# Altium schematic sheet CUSP_PI_Hat.SchDoc
size A4; SheetNumber: 1; SheetTotal: 1
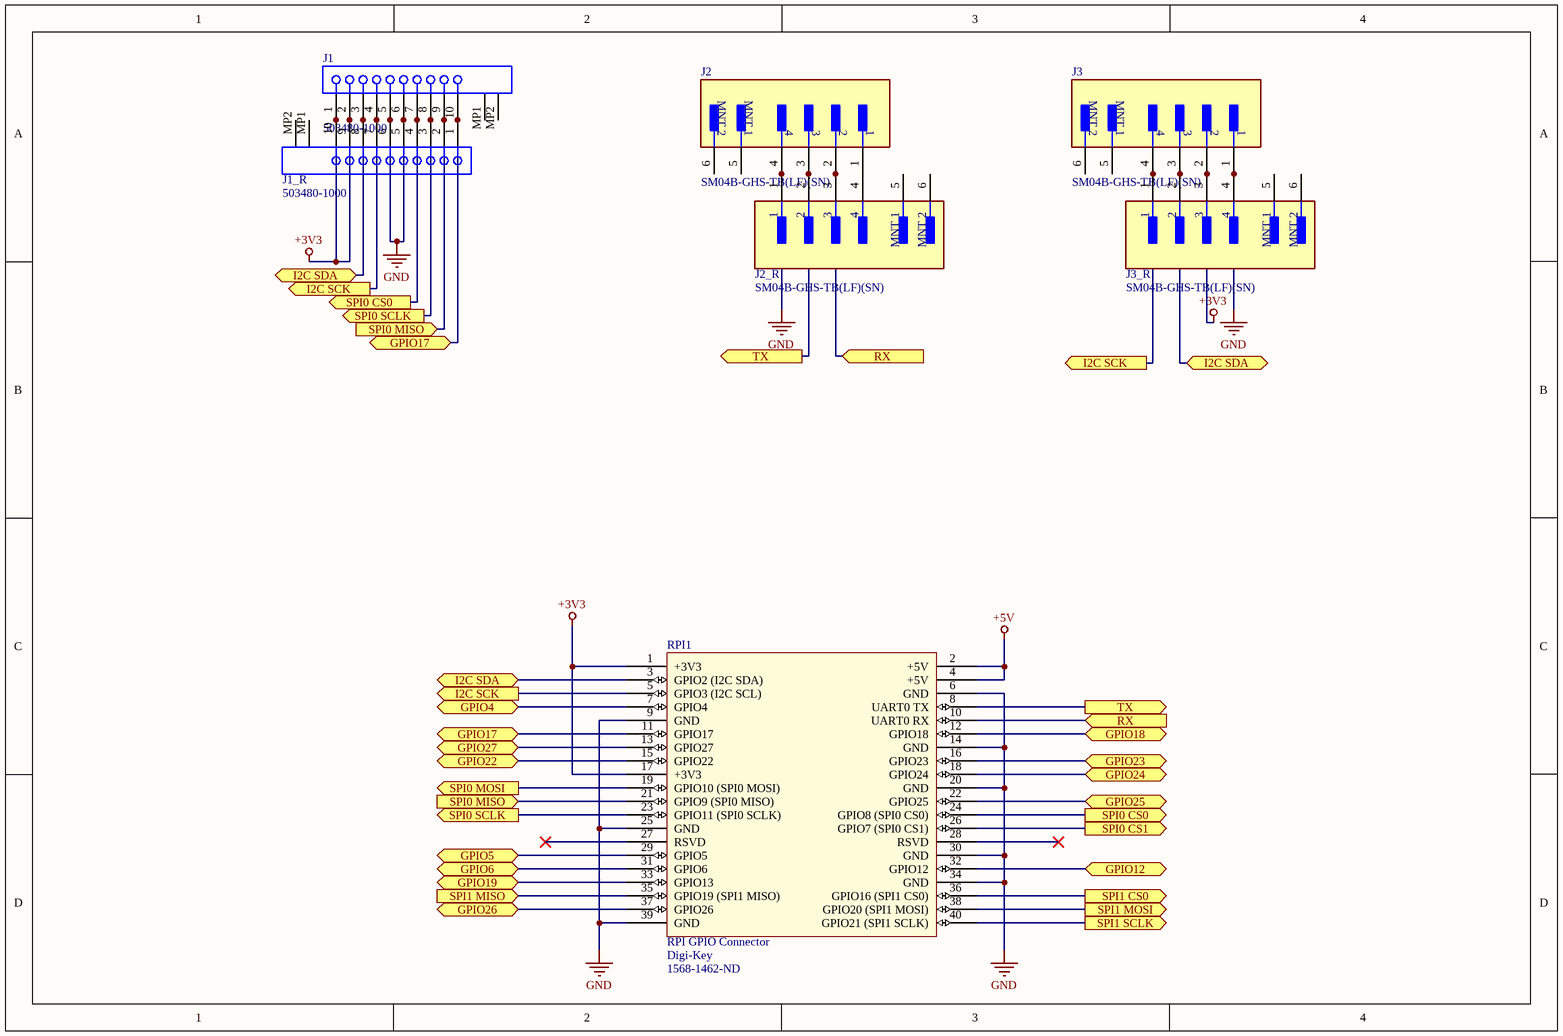
[diagram p0: CUSP_PI_Hat.SchDoc]

## Parts
J1  503480-1000  [MOLX-503480-1000]
J1_R  503480-1000  [MOLX-503480-1000]
J2  SM04B-GHS-TB(LF)(SN)  [FP-SM04B-GHS-TB_LF_SN-MFG]
J2_R  SM04B-GHS-TB(LF)(SN)  [FP-SM04B-GHS-TB_LF_SN-MFG]
J3  SM04B-GHS-TB(LF)(SN)  [FP-SM04B-GHS-TB_LF_SN-MFG]
J3_R  SM04B-GHS-TB(LF)(SN)  [FP-SM04B-GHS-TB_LF_SN-MFG]
RPI1  RPI GPIO Connector  Supplier 1: Digi-Key  Supplier Part Number 1: 1568-1462-ND  [rpi]

## Ports
GPIO4 (bidir), GPIO5 (bidir), GPIO6 (bidir), GPIO12 (bidir), GPIO17 (bidir), GPIO18 (bidir), GPIO19 (bidir), GPIO22 (bidir), GPIO23 (bidir), GPIO24 (bidir), GPIO25 (bidir), GPIO26 (bidir), GPIO27 (bidir), I2C SCK (out), I2C SDA (bidir), RX (in), SPI0 CS0 (out), SPI0 CS1 (out), SPI0 MISO (in), SPI0 MOSI (out), SPI0 SCLK (out), SPI1 CS0 (out), SPI1 MISO (in), SPI1 MOSI (out), SPI1 SCLK (out), TX (out)

## Nets
+3V3: J1.1 J1.2 J1_R.9 J1_R.10 J3.2 J3_R.3 RPI1.1(+3V3) RPI1.17(+3V3)
+5V: RPI1.2(+5V) RPI1.4(+5V)
GND: J1.5 J1.6 J1_R.5 J1_R.6 J2.4 J2_R.1 J3.1 J3_R.4 RPI1.6(GND) RPI1.9(GND) RPI1.14(GND) RPI1.20(GND) RPI1.25(GND) RPI1.30(GND) RPI1.34(GND) RPI1.39(GND)
GPIO4: RPI1.7(GPIO4) ; port GPIO4
GPIO5: RPI1.29(GPIO5) ; port GPIO5
GPIO6: RPI1.31(GPIO6) ; port GPIO6
GPIO12: RPI1.32(GPIO12) ; port GPIO12
GPIO17: J1.10 J1_R.1 RPI1.11(GPIO17) ; port GPIO17
GPIO18: RPI1.12(GPIO18) ; port GPIO18
GPIO19: RPI1.33(GPIO13) ; port GPIO19
GPIO22: RPI1.15(GPIO22) ; port GPIO22
GPIO23: RPI1.16(GPIO23) ; port GPIO23
GPIO24: RPI1.18(GPIO24) ; port GPIO24
GPIO25: RPI1.22(GPIO25) ; port GPIO25
GPIO26: RPI1.37(GPIO26) ; port GPIO26
GPIO27: RPI1.13(GPIO27) ; port GPIO27
I2C SCK: J1.4 J1_R.7 J3.4 J3_R.1 RPI1.5(GPIO3_(I2C_SCL)) ; port I2C SCK
I2C SDA: J1.3 J1_R.8 J3.3 J3_R.2 RPI1.3(GPIO2_(I2C_SDA)) ; port I2C SDA
RX: J2.2 J2_R.3 RPI1.10(UART0_RX) ; port RX
SPI0 CS0: J1.7 J1_R.4 RPI1.24(GPIO8_(SPI0_CS0)) ; port SPI0 CS0
SPI0 CS1: RPI1.26(GPIO7_(SPI0_CS1)) ; port SPI0 CS1
SPI0 MISO: J1.9 J1_R.2 RPI1.21(GPIO9_(SPI0_MISO)) ; port SPI0 MISO
SPI0 MOSI: RPI1.19(GPIO10_(SPI0_MOSI)) ; port SPI0 MOSI
SPI0 SCLK: J1.8 J1_R.3 RPI1.23(GPIO11_(SPI0_SCLK)) ; port SPI0 SCLK
SPI1 CS0: RPI1.36(GPIO16_(SPI1_CS0)) ; port SPI1 CS0
SPI1 MISO: RPI1.35(GPIO19_(SPI1_MISO)) ; port SPI1 MISO
SPI1 MOSI: RPI1.38(GPIO20_(SPI1_MOSI)) ; port SPI1 MOSI
SPI1 SCLK: RPI1.40(GPIO21_(SPI1_SCLK)) ; port SPI1 SCLK
TX: J2.3 J2_R.2 RPI1.8(UART0_TX) ; port TX
NetJ2_1: J2.1 J2_R.4

Not connected (* = marked no-connect by the designer): J1 MP1 MP2; J1_R MP1 MP2; J2 5(MNT_1) 6(MNT_2); J2_R 5(MNT_1) 6(MNT_2); J3 5(MNT_1) 6(MNT_2); J3_R 5(MNT_1) 6(MNT_2); RPI1 27(RSVD)* 28(RSVD)*

## Library data of the parts
J1 J1_R = CMP-1241-00115-1: 0.5 mm Pitch Easy-On(TM) BackFlip(TM) Type FPC Connector, 1.0 mm Mated Height, Right Angle, SMT, Dual Contact, 10 Circuits, -40 to 85 degC, ELV and RoHS Compliant, Tape and Reel; Manufacturer: Molex; Durability (mating cycles max): 10; Pitch - Mating Interface: 0.50mm; Material - Plating Mating: Gold; Voltage (Max): 50V AC (RMS)/DC; Polarized to PCB: Yes; PCB Locator: No; Current (Max per Contact): 0.5A; Material - Plating Termination: Gold, Tin; Entry Angle: 90degrees Angle; Mated Height: 1.00mm; Material - Metal: Phosphor Bronze; ComponentLink1Description: Manufacturer URL; PartNumber: 503480-1000; Circuits (Loaded): 10; Packing: Tape and Reel; PackageReference: 503480-1000; ComponentLink2URL: http://www.molex.com/webdocs/datasheets/pdf/en-us/5034801000_FFC_FPC_CONNECTORS.pdf; PackageVersion: Rev. F, 09/2012; ComponentLink3Description: Package Specification; ComponentLink3URL: http://www.molex.com/pdm_docs/sd/5034801000_sd.pdf; PackageDescription: 10-Lead FPC Connector, Pitch 0.5 mm; Stackable: No; Mounting Technology: Surface Mount; ComponentLink2Description: Datasheet; PCB Retention: Yes; Number of Rows: 1; Orientation: Right Angle; Contact Position: Dual; RoHS: TRUE; ComponentLink1URL: http://www.molex.com/molex/index.jsp
J2 J2_R J3 J3_R = CMP-17439-000411-1: CONN HEADER SMD R/A 4POS 1.25MM; Voltage Rating: 50V; Number of Contacts: 4; Current Rating: 1A; Termination: Solder; Mount: Surface Mount; REACH SVHC: No SVHC; Packaging: Cut Tape; Contact Material: Bronze; Series: GH; Orientation: Right Angle; Lead Free: Lead Free; Housing Material: Nylon; Contact Plating: Tin; Housing Color: Natural; Number of Rows: 1; Pitch: 1.25mm; Number of Positions: 4
RPI1 = rpi connector: GPIO Header for Raspberry Pi A+/B+/Pi 2/Pi 3 - 2x20; Manufacturer: SparkFun Electronics; Manufacturer Part Number: PRT-14017; Nils Minor: author; nilsminor@web.de: mail; RoHS: RoHS Compliant; Category: Development Boards, Kits, Programmers; Stock 1: 150; Pricing 1: 1=1.84 (EUR); Part Status: Active; Accessory Type: Connector; For Use With/Related Products: Raspberry Pi; ComponentLink1URL: https://cdn.sparkfun.com/datasheets/Dev/RaspberryPi/12313.pdf; ComponentLink1Description: https://cdn.sparkfun.com/datasheets/Dev/RaspberryPi/12313.pdf